# Altium schematic sheet SMPS_5V_A.SchDoc: SMPS  5V Using LM22675
size B; Date: 2015-01-16; Author: Marcin Czajkowski; CompanyName: Conestoga College; DrawnBy: Marcin Czajkowski; Organization: Marcin Czajkowski; Address1: SN: 3547684; Address2: ESE-Y2; Address3: Conestoga College; Address4: Project IV; DocumentNumber: 1; Revision: A; SheetNumber: 4; SheetTotal: 14; ProjectName: SMPS  5V Using LM22675
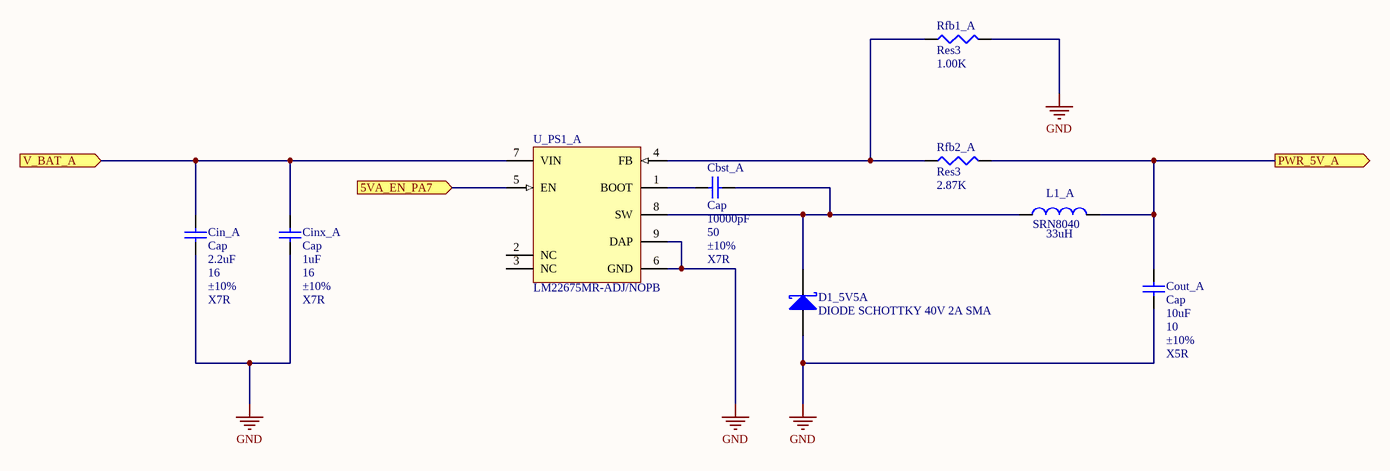
[diagram p0: SMPS_5V_A.SchDoc]

## Parts
Cbst_A  Cap  value 10000pF  WV: 50  Tolerance: ±10%  Type: X7R  [CAPC2012X09M]
Cin_A  Cap  value 2.2uF  WV: 16  Tolerance: ±10%  Type: X7R  [CAPC2012X09M]
Cinx_A  Cap  value 1uF  WV: 16  Tolerance: ±10%  Type: X7R  [CAPC2012X09M]
Cout_A  Cap  value 10uF  WV: 10  Tolerance: ±10%  Type: X5R  [CAPC2012X09M]
D1_5V5A  DIODE SCHOTTKY 40V 2A SMA  [DIOM4326X23M]
L1_A  SRN8040  Val: 33uH  [INDP8080X40M]
Rfb1_A  Res3  value 1.00K  [RESC2112X05M]
Rfb2_A  Res3  value 2.87K  [RESC2112X05M]
U_PS1_A  LM22675MR-ADJ/NOPB  [MRA08B_L]

## Ports
5VA_EN_PA7 (in), PWR_5V_A (out), V_BAT_A (in)

## Nets
GND: Cin_A.1 Cinx_A.1 Cout_A.1 D1_5V5A.2(A) Rfb1_A.2 U_PS1_A.6(GND) U_PS1_A.9(DAP)
5VA_EN_PA7: U_PS1_A.5(EN) ; port 5VA_EN_PA7
PWR_5V_A: Cout_A.2 L1_A.2 Rfb2_A.2 ; port PWR_5V_A
V_BAT_A: Cin_A.2 Cinx_A.2 U_PS1_A.7(VIN) ; port V_BAT_A
NetCbst_A_1: Cbst_A.1 U_PS1_A.1(BOOT)
NetCbst_A_2: Cbst_A.2 D1_5V5A.1(K) L1_A.1 U_PS1_A.8(SW)
NetRfb1_A_1: Rfb1_A.1 Rfb2_A.1 U_PS1_A.4(FB)

Not connected (* = marked no-connect by the designer): U_PS1_A 2(NC) 3(NC)

## Notes on the sheet
- ESE
- is the sole property of ESE. Any reproduction
- The Information Contained in this drawing
- Schematic P/N and Name
- Sheet Name
- 299 Doon Valley Drive
- Kitchener, ON N2G 4M4
- Canada
- Approved
- in part or in whole without the written
- permission of ESE is strictly prohibited.
- APPROVALS
- DATE
- Size
- Scale
- B
- NTS
- Bare PCB P/N
- Date
- Sheet
- Rev.
- Checked
- Engineer
- of

## Library data of the parts
Cbst_A = CAP-X7R-10000pF-50V-±10%: CAP CER 10000pF 50v X7R 0805; MPN: C0805C103K5RACTU; PN: 399-1158-1-ND; Name: CAP-X7R-10000pF-50V-±10%; URL: http://www.digikey.ca/product-detail/en/C0805C103K5RACTU/399-1158-1-ND
Cin_A = CAP-X7R-2.2uF-16V-±10%: CAP CER 2.2uF 16v X7R 0805; MPN: C0805C225K4RACTU; PN: 399-3523-1-ND; Name: CAP-X7R-2.2uF-16V-±10%; URL: http://www.digikey.ca/product-detail/en/C0805C225K4RACTU/399-3523-1-ND
Cinx_A = CAP-X7R-1uF-16V-±10%: CAP CER 1uF 16v X7R 0805; MPN: C0805C105K4RACTU; PN: 399-1284-1-ND; Name: CAP-X7R-1uF-16V-±10%; URL: http://www.digikey.ca/product-detail/en/C0805C105K4RACTU/399-1284-1-ND
Cout_A = CAP-X5R-10uF-10V-±10%: CAP CER 10uF 10v X5R 0805; MPN: C0805C106K8PACTU; PN: 399-4925-1-ND; Name: CAP-X5R-10uF-10V-±10%; URL: http://www.digikey.ca/product-detail/en/C0805C106K8PACTU/399-4925-1-ND
D1_5V5A = DIODE SCHOTTKY 40V 2A SMA: Schottky Rectifier; MPN: B240A-13-F; PN: B240A-FDICT-ND; URL: http://www.digikey.ca/product-detail/en/B240A-13-F/B240A-FDICT-ND
L1_A = SRN8040: FIXED IND 33UH 1.7A 145 MOHM SMD; MPN: SRN8040-220M; PN: SRN8040-330MCT-ND; URL: http://www.digikey.ca/product-detail/en/SRN8040-330M/SRN8040-330MCT-ND/2756183
Rfb1_A = Resistor_1.00K: RES SMD 1.00K OHM 1% 1/8W 0805; MPN: CRCW08051K00FKEA; PN: 541-1.00KCCT-ND; Name: Resistor_1.00K; URL: http://www.digikey.ca/product-detail/en/CRCW08051K00FKEA/541-1.00KCCT-ND
Rfb2_A = Resistor_2.87K: RES SMD 2.87K OHM 1% 1/8W 0805; MPN: CRCW08052K87FKEA; PN: 541-2.87KCCT-ND; Name: Resistor_2.87K; URL: http://www.digikey.ca/product-detail/en/CRCW08052K87FKEA/541-2.87KCCT-ND
U_PS1_A = LM22675MR-ADJ/NOPB: 1A SIMPLE SWITCHER®, Step-Down Voltage Regulator with Precision Enable, 8-pin PSOP, Pb-Free; Manufacturer: National Semiconductor; MPN: LM22675MRE-ADJ/NOPB; PackageTopMarking: NSXYTT*L22675*ADJ; PowerWise: N; High-Reliability: Y; PN: LM22675MRE-ADJ/NOPBCT-ND; DatasheetVersion: Dec-2010; PackageVersion: revB, Dec-2007; PackageReference: MRA08B; PackageDescription: Molded, PSOP .193 x .154 x .058in, 8 Lead, .050in Pitch, Large DAP; PartNumber: LM22675MR-ADJ/NOPB; RoHS: Y; PinCount: 8; CompType: Switcher; Code_JEDEC: MS-012-AA; ComponentLink1Description: Manufacturer URL; ComponentLink1URL: http://www.national.com/; ComponentLink2Description: LM22675 Datasheet; ComponentLink2URL: http://www.national.com/ds/LM/LM22675.pdf; ComponentLink3Description: LM22675 Web Page; ComponentLink3URL: http://www.national.com/pf/LM/LM22675.html; ComponentLink4Description: MRA08B Package Page; ComponentLink4URL: http://www.national.com/packaging/folders/mra08b.html; URL: http://www.digikey.ca/product-detail/en/LM22675MRE-ADJ%2FNOPB/LM22675MRE-ADJ%2FNOPBCT-ND